# Altium project HoverBall_power.PrjPcb
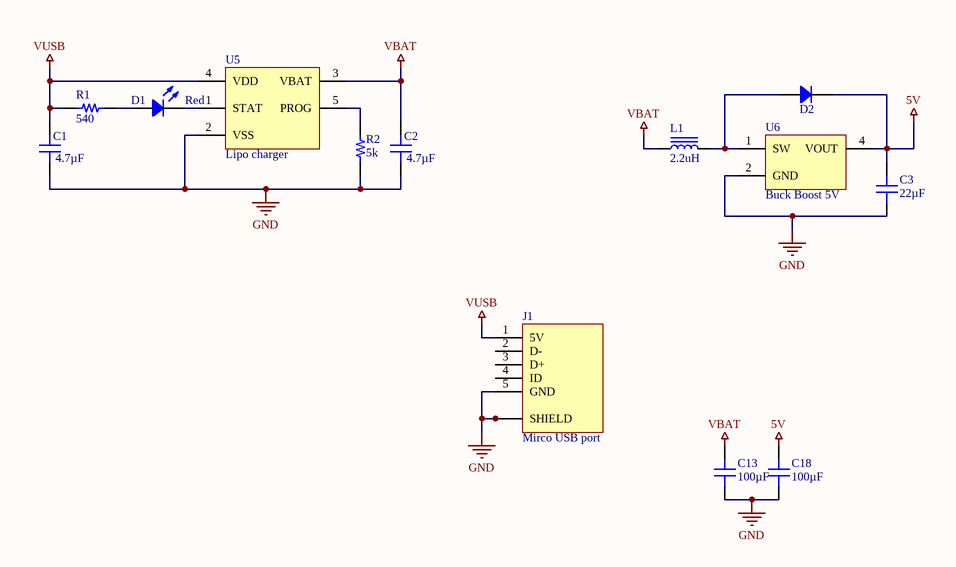
[diagram p0: Top.SchDoc]
1 sheet, 13 parts. Net scope: global (net labels, ports and power ports of the same name join across sheets).
Board file: HoverBall_power.PcbDoc

## Sheet Top.SchDoc
size A

### Parts
C1  4.7µF  [CAP 0603_1608]
C2  4.7µF  [CAP 0603_1608]
C3  22µF  [CAP 1210_3225 - 2.8MM]
C13  100µF  [CAP 1210_3225 - 2.8MM]
C18  100µF  [CAP 1210_3225 - 2.8MM]
D1  Red  [LED 0603_1608 RED]
D2  V1F6-M3/H  [SMF DO-219AB]  (value not drawn)
J1  Mirco USB port  [GCT_USB3131-30-0230-A_REVB]
L1  2.2uH  [TAIYO YUDEN MAMK2520T1R0M]
R1  540  [RES 0603_1608]
R2  5k  [RES 0603_1608]
U5  Lipo charger  [TI SOT-23-5 DBV]
U6  Buck Boost 5V  [TI SOT-23-5 DBV]

### Nets
5V: C3.2 C18.2 D2.2 U6.4(VOUT)
GND: C1.2 C2.2 C3.1 C13.1 C18.1 J1.5(GND) J1.S1(SHIELD) J1.S2(SHIELD) R2.2 U5.2(VSS) U6.2(GND)
VBAT: C2.1 C13.2 L1.1 U5.3(VBAT)
VUSB: C1.1 J1.1(5V) R1.1 U5.4(VDD)
NetD1_1: D1.1 R1.2
NetD1_2: D1.2 U5.1(STAT)
NetD2_1: D2.1 L1.2 U6.1(SW)
NetR2_1: R2.1 U5.5(PROG)

Not connected (* = marked no-connect by the designer): J1 2(D-) 3(D+) 4(ID)

### Library data of the parts
C1 C2 = GCG188R92A104KA03D: CAP CER 0.1UF 100V 0603 EPOXY; Manufacturer: Murata Electronics; Capacitance: 0.1µF; Temperature Coefficient: X8R; Tolerance: ±10%; Part Number: GCG188R92A104KA03D; Value: 4.7µF; Applications: Automotive; ComponentLink1Description: Datasheet; ComponentLink1URL: https://search.murata.co.jp/Ceramy/image/img/A01X/G101/ENG/GCG188R92A104KA03-01.pdf; ComponentLink2Description: DigiKey Link; ComponentLink2URL: http://digikey.com/product-detail/en/murata-electronics/GCG188R92A104KA03D/490-18197-1-ND/9867926; Device Package: 0603 (1608 Metric); Features: Epoxy Mountable; LastUpdated: 21-Jan-20 12:01:59 AM; Lifecycle Status: Active; Minimum Order: 1; Mounting Type: Surface Mount, MLCC, Epoxy; Operating Temperature: -55°C ~ 150°C; Package / Case: 0603 (1608 Metric); Packaging: TapeAndReel; PartId: 9025; Part Status: Active; Price: 0.07; Ratings: AEC-Q200; Series: GCG; Size / Dimension: 0.063" L x 0.031" W (1.60mm x 0.80mm); Supplier 1: DigiKey; Supplier Part Number 1: 490-18197-1-ND; Thickness (Max): 0.035" (0.90mm); Voltage - Rated: 100V
C3 = EMK325ABJ107MM-P: CAP CER 100UF 16V X5R 1210; Manufacturer: Taiyo Yuden; Capacitance: 100µF; Tolerance: ±20%; Part Number: EMK325ABJ107MM-P; Value: 22µF; Applications: General Purpose; ComponentLink1Description: Datasheet; ComponentLink1URL: https://ds.yuden.co.jp/TYCOMPAS/ut/detail?pn=EMK325ABJ107MM-P &u=M; ComponentLink2Description: DigiKey Link; ComponentLink2URL: http://digikey.com/product-detail/en/taiyo-yuden/EMK325ABJ107MM-P/587-5426-1-ND/7067102; Device Package: 1210 (3225 Metric); LastUpdated: 21-Jan-20 12:30:21 AM; Lifecycle Status: Active; Minimum Order: 1; Mounting Type: Surface Mount, MLCC; Operating Temperature: -55°C ~ 85°C; Package / Case: 1210 (3225 Metric); Packaging: TapeAndReel; PartId: 24141; Part Status: Active; Price: 0.71; Series: M; Size / Dimension: 0.126" L x 0.098" W (3.20mm x 2.50mm); Supplier 1: DigiKey; Supplier Part Number 1: 587-5426-1-ND; Temperature Coefficient: X5R; Thickness (Max): 0.110" (2.80mm); Voltage - Rated: 16V
C13 C18 = EMK325ABJ107MM-P: CAP CER 100UF 16V X5R 1210; Manufacturer: Taiyo Yuden; Tolerance: ±20%; Part Number: EMK325ABJ107MM-P; Value: 100µF; Applications: General Purpose; Capacitance: 100µF; ComponentLink1Description: Datasheet; ComponentLink1URL: https://ds.yuden.co.jp/TYCOMPAS/ut/detail?pn=EMK325ABJ107MM-P &u=M; ComponentLink2Description: DigiKey Link; ComponentLink2URL: http://digikey.com/product-detail/en/taiyo-yuden/EMK325ABJ107MM-P/587-5426-1-ND/7067102; Device Package: 1210 (3225 Metric); LastUpdated: 21-Jan-20 12:30:21 AM; Lifecycle Status: Active; Minimum Order: 1; Mounting Type: Surface Mount, MLCC; Operating Temperature: -55°C ~ 85°C; Package / Case: 1210 (3225 Metric); Packaging: TapeAndReel; PartId: 24141; Part Status: Active; Price: 0.71; Series: M; Size / Dimension: 0.126" L x 0.098" W (3.20mm x 2.50mm); Supplier 1: DigiKey; Supplier Part Number 1: 587-5426-1-ND; Temperature Coefficient: X5R; Thickness (Max): 0.110" (2.80mm); Voltage - Rated: 16V
D1 = 5973005507F: LED RED 0603 SMD; Manufacturer: Dialight; Configuration: Standard; Current - Test: 20mA; Lens Color: 0.68mm; Lens Size: 1.20mm x 0.80mm; Lens Style: Rectangle with Flat Top; Millicandela Rating: 90mcd; Voltage - Forward (Vf) (Typ): 2V; Wavelength - Dominant: 630nm; Part Number: 5973005507F; Color: Red; ComponentLink1Description: Datasheet; ComponentLink1URL: http://www.dialightsignalsandcomponents.com/Assets/Drawings/2D_Drawings_DrawingDetailedSpec/NewDrawings/18369A.pdf; ComponentLink2Description: DigiKey Link; ComponentLink2URL: http://digikey.com/product-detail/en/dialight/5973005507F/350-4374-1-ND/9385480; Device Package: 0603 (1608 Metric); Height (Max): 0.68mm; LastUpdated: 9/2/2020 1:20:57 AM; Lifecycle Status: Active; Minimum Order: 1; Mounting Type: Surface Mount; Package / Case: 0603 (1608 Metric); Packaging: TapeAndReel; PartId: 378; Part Status: Active; Price: 0.11; Series: 597; Size / Dimension: 1.60mm L x 0.80mm W; Supplier 1: DigiKey; Supplier Part Number 1: 350-4374-1-ND; Supplier Device Package: 0603; Value: Red
D2 = V1F6-M3/H: 1A 60V SMF TRENCH SKY RECT; Manufacturer: Vishay Semiconductor Diodes Division; Capacitance @ Vr, F: 135pF @ 4V, 1MHz; Current - Reverse Leakage @ Vr: 270µA @ 60V; Diode Type: Schottky; Speed: Fast Recovery =< 500ns, > 200mA (Io); Voltage - Forward (Vf) (Max) @ If: 600mV @ 1A; Part Number: V1F6-M3/H; ComponentLink1Description: Datasheet; ComponentLink1URL: http://www.vishay.com/docs/87555/v1f6.pdf; ComponentLink2Description: DigiKey Link; ComponentLink2URL: http://digikey.com/product-detail/en/vishay-semiconductor-diodes-division/V1F6-M3-H/112-V1F6-M3-HCT-ND/10660586; Current - Average Rectified (Io): 1A; LastUpdated: 02-Sep-20 1:23:13 AM; Lifecycle Status: Active; Minimum Order: 1; Mounting Type: Surface Mount; Operating Temperature - Junction: -40°C ~ 150°C; Package / Case: DO-219AB; Packaging: Unknown; PartId: 3272; Part Status: Active; Price: 0.07; Series: eSMP®, TMBS®; Supplier 1: DigiKey; Supplier Part Number 1: 112-V1F6-M3/HCT-ND; Supplier Device Package: DO-219AB (SMF); Voltage - DC Reverse (Vr) (Max): 60V
J1 = USB3131-30-0230-A: USB - micro B USB 2.0 Receptacle Connector 5 Position Through Hole; MF: Amphenol ICC; MP: 10118194-0001LF; Package: None; Price: None; Availability: Unavailable; SnapEDA_Link: https://www.snapeda.com/parts/10118194-0001LF/Amphenol%20FCI/view-part/1413308/?ref=snap; Value: *
L1 = MAKK2520TR47M: FIXED IND 470NH 3.2A 46 MOHM SMD; Manufacturer: Taiyo Yuden; Current - Saturation: 3.9A; DC Resistance (DCR): 46mOhm Max; Inductance Frequency - Test: 2MHz; Material - Core: Metal; Shielding: Shielded; Tolerance: ±20%; Type: Wirewound; Part Number: MAKK2520TR47M; ComponentLink1Description: Datasheet; ComponentLink1URL: https://ds.yuden.co.jp/TYCOMPAS/ut/detail?pn=MAKK2520TR47M  &u=M; ComponentLink2Description: DigiKey Link; ComponentLink2URL: http://digikey.com/product-detail/en/taiyo-yuden/MAKK2520TR47M/587-4145-1-ND/5035305; Current Rating (Amps): 3.2A; Device Package: 1008 (2520 Metric); Height - Seated (Max): 0.039" (1.00mm); Inductance: 470nH; LastUpdated: 9/2/2020 1:22:11 AM; Lifecycle Status: Active; Minimum Order: 1; Mounting Type: Surface Mount; Operating Temperature: -40°C ~ 105°C; Package / Case: 1008 (2520 Metric); Packaging: TapeAndReel; PartId: 69; Part Status: Active; Price: 0.09; Series: MCOIL™, MA; Size / Dimension: 0.098" L x 0.079" W (2.50mm x 2.00mm); Supplier 1: DigiKey; Supplier Part Number 1: 587-4145-1-ND; Supplier Device Package: 1008 (2520 Metric); Value: 470nH
R1 R2 = RNCS0603BKE10K0: RES 10K OHM 0.1% 1/16W 0603; Manufacturer: Stackpole Electronics Inc; Power (Watts): 0.063W, 1/16W; Resistance: 10 kOhms; Temperature Coefficient: ±25ppm/°C; Part Number: RNCS0603BKE10K0; ComponentLink1Description: Datasheet; ComponentLink1URL: https://www.seielect.com/catalog/sei-rncs_rnch.pdf; ComponentLink2Description: DigiKey Link; ComponentLink2URL: http://digikey.com/product-detail/en/stackpole-electronics-inc/RNCS0603BKE10K0/RNCS0603BKE10K0CT-ND/1800113; Composition: Thin Film; Device Package: 0603 (1608 Metric); Features: Anti-Corrosive, Automotive AEC-Q200, Moisture Resistant; Height - Seated (Max): 0.022" (0.55mm); LastUpdated: 21-Jan-20 12:25:01 AM; Lifecycle Status: Active; Minimum Order: 1; Number of Terminations: 2; Operating Temperature: -55°C ~ 155°C; Package / Case: 0603 (1608 Metric); Packaging: TapeAndReel; PartId: 4838; Part Status: Active; Price: 0.08; Ratings: AEC-Q200; Series: RNCS; Size / Dimension: 0.061" L x 0.031" W (1.55mm x 0.80mm); Supplier 1: DigiKey; Supplier Part Number 1: RNCS0603BKE10K0CT-ND; Supplier Device Package: 0603; Tolerance: ±0.1%
  R1: Value: 540
  R2: Value: 5k
U5 = MCP73831
U6 = TPS613222A: ADJ step down Buck

## Assembly variants
Main: not fitted J5 M1 M2 P1 P2 P3 P6 P6 P7 P7 P8 P8 P9 P9 R8 R14